# EAGLE design FollowerCounter_60mm_v010 (EAGLE 9.6.2)
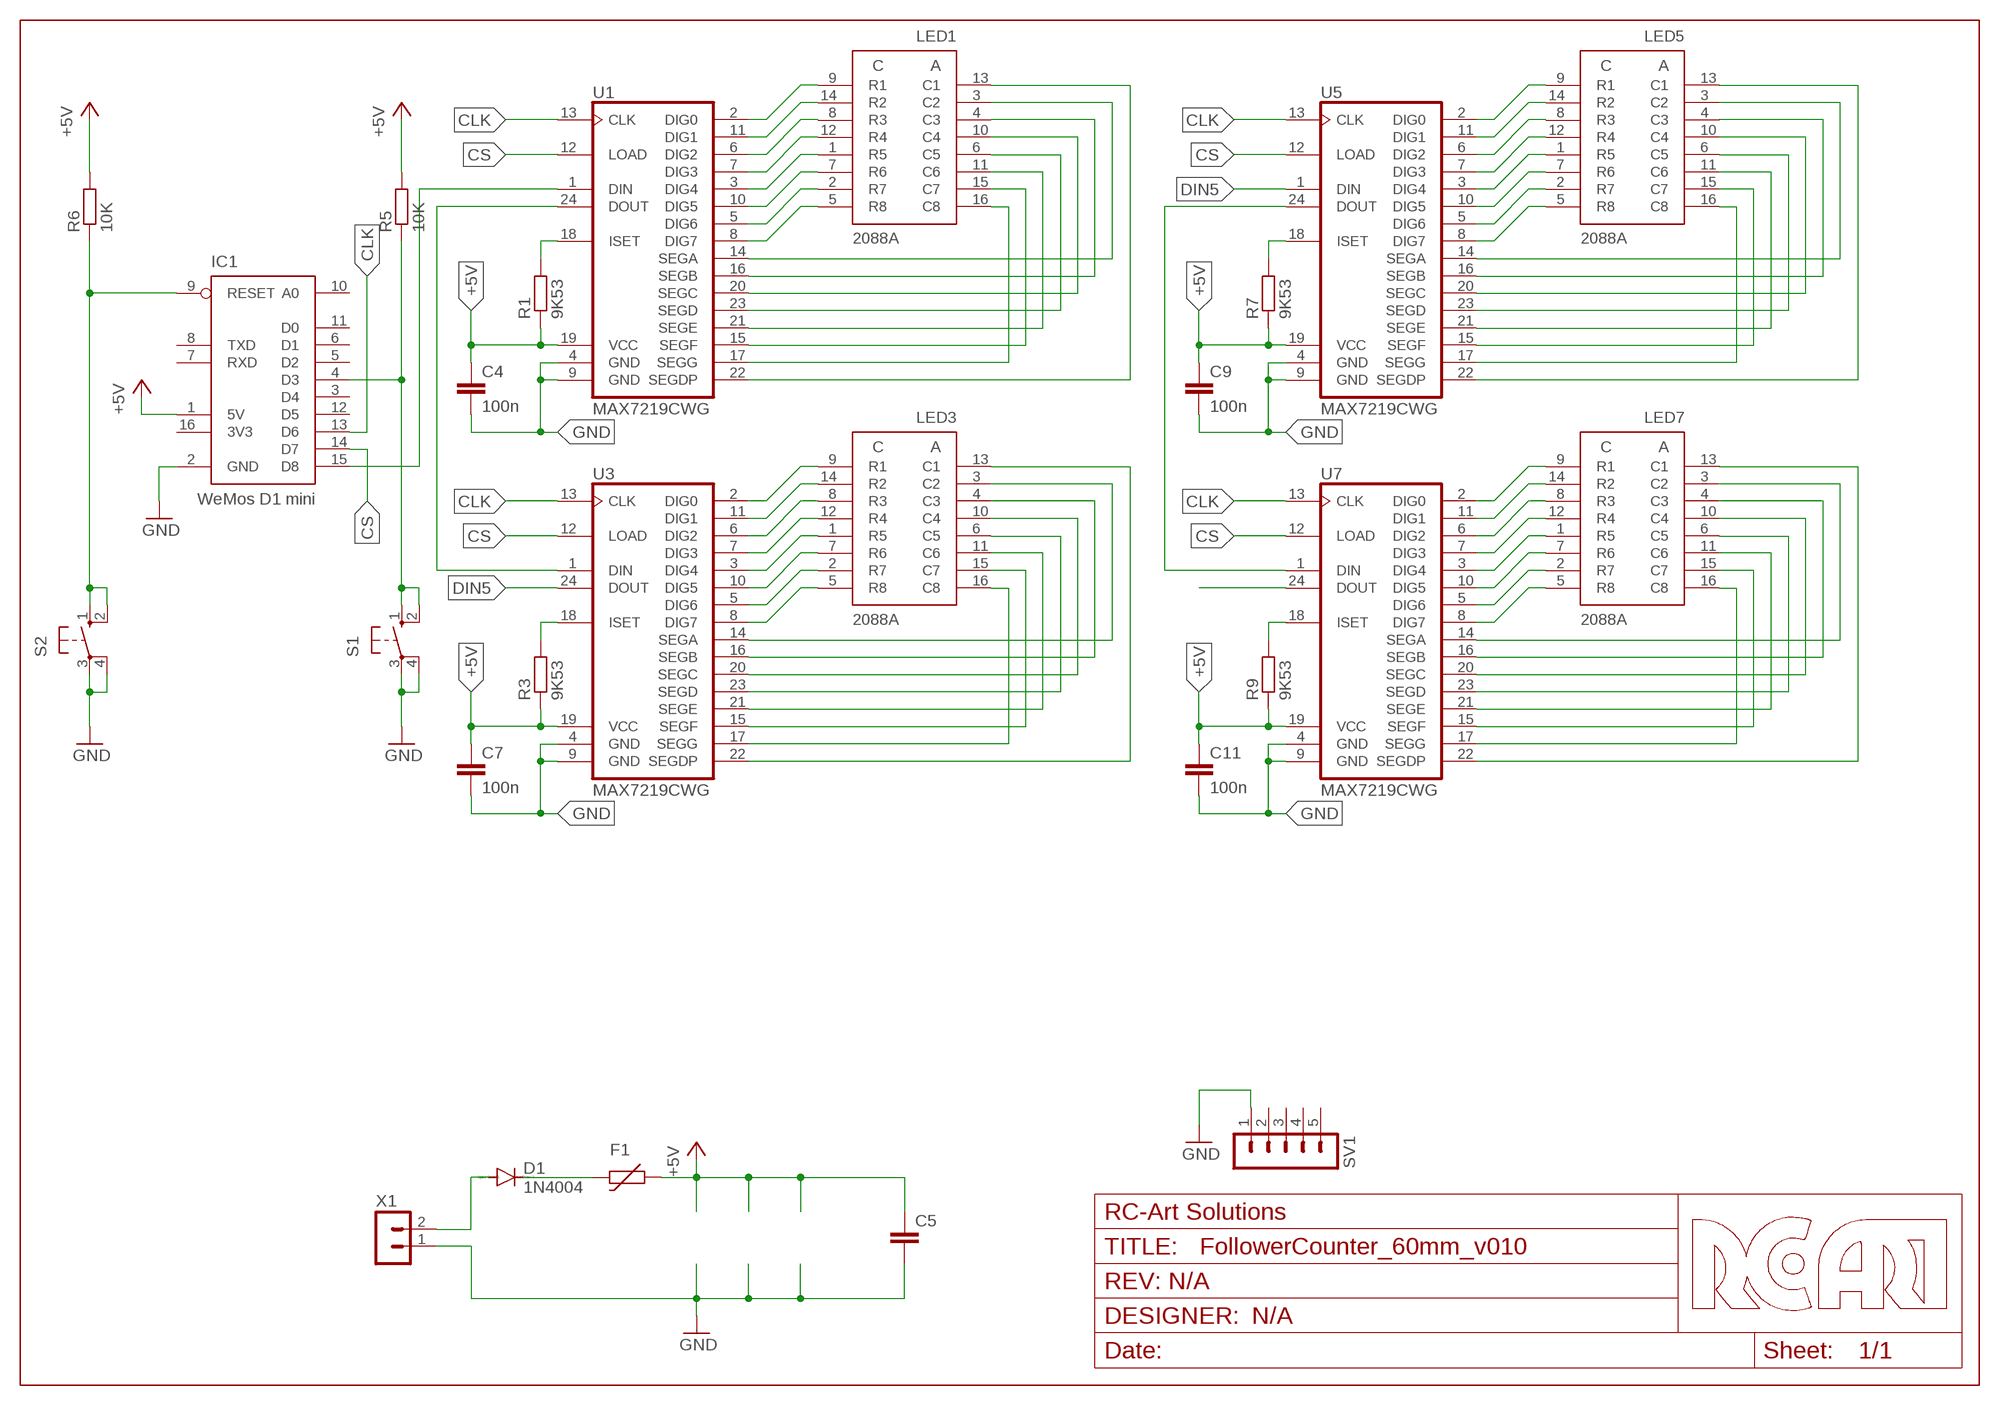
[diagram p0: schematic, sheet 1]

## Parts
C4  100n  C-EUC0805  [C0805]
C5  C-EUC0805  [C0805]
C7  100n  C-EUC0805  [C0805]
C9  100n  C-EUC0805  [C0805]
C11  100n  C-EUC0805  [C0805]
D1  1N4004  [DO41-10]
F1  MF-MSMF075/24-EU  [1812]
FRAME1  MF_FRAMEDEFAULT  [MF_FRAME_DEFAULT]
IC1  WeMos D1 mini  D1_MINI  [D1_MINI]
LED1  2088A  [8X8_60X60]
LED3  2088A  [8X8_60X60]
LED5  2088A  [8X8_60X60]
LED7  2088A  [8X8_60X60]
R1  9K53  R-EU_R0805  [R0805]
R3  9K53  R-EU_R0805  [R0805]
R5  10K  R-EU_R0805  [R0805]
R6  10K  R-EU_R0805  [R0805]
R7  9K53  R-EU_R0805  [R0805]
R9  9K53  R-EU_R0805  [R0805]
S1  10-XXS  [B3FS-10XX]
S2  10-XXS  [B3FS-10XX]
SV1  MA05-1  [MA05-1]
U1  MAX7219CWG  [SO24L]
U3  MAX7219CWG  [SO24L]
U5  MAX7219CWG  [SO24L]
U7  MAX7219CWG  [SO24L]
X1  MA02-1  [MA02-1]

## Nets
+5V: C4.1 C5.1 C7.1 C9.1 C11.1 F1.1 IC1.1(5V) R1.1 R3.1 R5.2 R6.2 R7.1 R9.1 U1.19(VCC) U3.19(VCC) U5.19(VCC) U7.19(VCC)
CLK: IC1.13(D6) U1.13(CLK) U3.13(CLK) U5.13(CLK) U7.13(CLK)
COL9: LED1.16(C8) U1.17(SEGG)
COL10: LED1.15(C7) U1.15(SEGF)
COL11: LED1.11(C6) U1.21(SEGE)
COL12: LED1.6(C5) U1.23(SEGD)
COL13: LED1.10(C4) U1.20(SEGC)
COL14: LED1.4(C3) U1.16(SEGB)
COL15: LED1.3(C2) U1.14(SEGA)
COL16: LED1.13(C1) U1.22(SEGDP)
COL25: LED3.16(C8) U3.17(SEGG)
COL26: LED3.15(C7) U3.15(SEGF)
COL27: LED3.11(C6) U3.21(SEGE)
COL28: LED3.6(C5) U3.23(SEGD)
COL29: LED3.10(C4) U3.20(SEGC)
COL30: LED3.4(C3) U3.16(SEGB)
COL31: LED3.3(C2) U3.14(SEGA)
COL32: LED3.13(C1) U3.22(SEGDP)
COL41: LED5.16(C8) U5.17(SEGG)
COL42: LED5.15(C7) U5.15(SEGF)
COL43: LED5.11(C6) U5.21(SEGE)
COL44: LED5.6(C5) U5.23(SEGD)
COL45: LED5.10(C4) U5.20(SEGC)
COL46: LED5.4(C3) U5.16(SEGB)
COL47: LED5.3(C2) U5.14(SEGA)
COL48: LED5.13(C1) U5.22(SEGDP)
COL57: LED7.16(C8) U7.17(SEGG)
COL58: LED7.15(C7) U7.15(SEGF)
COL59: LED7.11(C6) U7.21(SEGE)
COL60: LED7.6(C5) U7.23(SEGD)
COL61: LED7.10(C4) U7.20(SEGC)
COL62: LED7.4(C3) U7.16(SEGB)
COL63: LED7.3(C2) U7.14(SEGA)
COL64: LED7.13(C1) U7.22(SEGDP)
CS: IC1.14(D7) U1.12(LOAD) U3.12(LOAD) U5.12(LOAD) U7.12(LOAD)
DIN1: IC1.15(D8) U1.1(DIN)
DIN5: U3.24(DOUT) U5.1(DIN)
DOUT1: U1.24(DOUT) U3.1(DIN)
DOUT5: U5.24(DOUT) U7.1(DIN)
DOUT7: U7.24(DOUT)
GND: C4.2 C5.2 C7.2 C9.2 C11.2 IC1.2(GND) S1.3(P) S1.4(P1) S2.3(P) S2.4(P1) SV1.1 U1.4(GND) U1.9(GND) U3.4(GND) U3.9(GND) U5.4(GND) U5.9(GND) U7.4(GND) U7.9(GND) X1.1
ISET1: R1.2 U1.18(ISET)
ISET3: R3.2 U3.18(ISET)
ISET5: R7.2 U5.18(ISET)
ISET7: R9.2 U7.18(ISET)
N$76: IC1.4(D3) R5.1 S1.1(S) S1.2(S1)
N$77: IC1.9(RESET) R6.1 S2.1(S) S2.2(S1)
N$78: D1.A X1.2
N$79: D1.C F1.2
ROW9: LED1.9(R1) U1.2(DIG0)
ROW10: LED1.14(R2) U1.11(DIG1)
ROW11: LED1.8(R3) U1.6(DIG2)
ROW12: LED1.12(R4) U1.7(DIG3)
ROW13: LED1.1(R5) U1.3(DIG4)
ROW14: LED1.7(R6) U1.10(DIG5)
ROW15: LED1.2(R7) U1.5(DIG6)
ROW16: LED1.5(R8) U1.8(DIG7)
ROW25: LED3.9(R1) U3.2(DIG0)
ROW26: LED3.14(R2) U3.11(DIG1)
ROW27: LED3.8(R3) U3.6(DIG2)
ROW28: LED3.12(R4) U3.7(DIG3)
ROW29: LED3.1(R5) U3.3(DIG4)
ROW30: LED3.7(R6) U3.10(DIG5)
ROW31: LED3.2(R7) U3.5(DIG6)
ROW32: LED3.5(R8) U3.8(DIG7)
ROW41: LED5.9(R1) U5.2(DIG0)
ROW42: LED5.14(R2) U5.11(DIG1)
ROW43: LED5.8(R3) U5.6(DIG2)
ROW44: LED5.12(R4) U5.7(DIG3)
ROW45: LED5.1(R5) U5.3(DIG4)
ROW46: LED5.7(R6) U5.10(DIG5)
ROW47: LED5.2(R7) U5.5(DIG6)
ROW48: LED5.5(R8) U5.8(DIG7)
ROW57: LED7.9(R1) U7.2(DIG0)
ROW58: LED7.14(R2) U7.11(DIG1)
ROW59: LED7.8(R3) U7.6(DIG2)
ROW60: LED7.12(R4) U7.7(DIG3)
ROW61: LED7.1(R5) U7.3(DIG4)
ROW62: LED7.7(R6) U7.10(DIG5)
ROW63: LED7.2(R7) U7.5(DIG6)
ROW64: LED7.5(R8) U7.8(DIG7)
Unconnected: IC1.3(D4) IC1.5(D2) IC1.6(D1) IC1.7(RXD) IC1.8(TXD) IC1.10(A0) IC1.11(D0) IC1.12(D5) IC1.16(3V3) SV1.2 SV1.3 SV1.4 SV1.5

## Library data of the parts
C4 C5 C7 C9 C11 = rcl:C-EU: CAPACITOR, European symbol; SPICEPREFIX: C
D1 = diode:1N4004: DIODE general purpose rectifier, 1 A
F1 = fuse-bourns:MF-MSMF*?-EU: PTC Resettable Fuse Documentation Datasheet <http://www.bourns.com/data/global/pdfs/mfmsmf.pdf> Features Compliant with AEC-Q200 Rev-C- Stress Test Qualification for Passive Components in Automotive Applications 100% electrically compatible with all previous generations of 1812 SMT devices Compatible with Pb and Pb-free solder reflow profiles RoHS compliant* and halogen free** Surface mount packaging for automated assembly Standard 4532 mm (1812 mils) footprint Patents pending; CATEGORY: Circuit Protection; CURRENT-MAX: 40A; CURRENT-TRIP: 1.5A; DESCRIPTION: PTC RESETTABLE .75A 24V 1812; DOCUMENTATION_LINK: <a href="http://www.bourns.com/data/global/pdfs/mfmsmf.pdf">Datasheet</a>; DOCUMENTATION_URL: http://www.bourns.com/data/global/pdfs/mfmsmf.pdf; FAMILY: PTC Resettable Fuses; MANUFACTURER: Bourns Inc.; PACKAGE: 1812 (4532 Metric), Concave; PART_NUMBER: MF-MSMF075/24-2; R_MINMAX: 0.11 ~ 0.450 Ohm; SERIES: MF-MSMF; SUPPLIER_ITEM_LINK: <a href="http://www.digikey.com/product-detail/en/MF-MSMF075%2F24-2/MF-MSMF075%2F24-2CT-ND/662844">Details</a>; SUPPLIER_ITEM_NUMBER: MF-MSMF075/24-2CT-ND; SUPPLIER_ITEM_URL: http://www.digikey.com/product-detail/en/MF-MSMF075%2F24-2/MF-MSMF075%2F24-2CT-ND/662844; SUPPLIER_LINK: <a href="http://www.digikey.com">Home Page</a>; SUPPLIER_NAME: Digi-Key; SUPPLIER_URL: http://www.digikey.com; TIME_TO_TRIP: 0.2s; VOLTAGE-MAX: 24V
FRAME1 = rca-frames:MF_FRAME: Library: MF_Aesthetics Description: Frame for adding Meta Data to the PCB and Schematic.; DNAME: N/A; HOUSEPART: 0; POPULATE: 0; REVNUM: REV: N/A
IC1 = rca-wemos:D1_MINI
LED1 LED3 LED5 LED7 = rca-led-matrix:2088A: 8 x 8 LED Matrix Common cathode type Module pitch = 60,2 mm
R1 R3 R5-R7 R9 = rcl:R-EU_: RESISTOR, European symbol; SPICEPREFIX: R
S1 S2 = switch_omron_ehp:10-XX: OMRON SWITCH Autor: Peter Weissig Datum: 20.02.2014 Hersteller: Omron
SV1 = con-lstb:MA05-1: PIN HEADER; OC_FARNELL: unknown; OC_NEWARK: unknown
U1 U3 U5 U7 = maxim-general:MAX7219CWG
X1 = rca-con-lstb:MA02-1: PIN HEADER

## Net classes
0 default: width 0.381 mm, drill 0.508 mm, clearance 0.254 mm

## Board
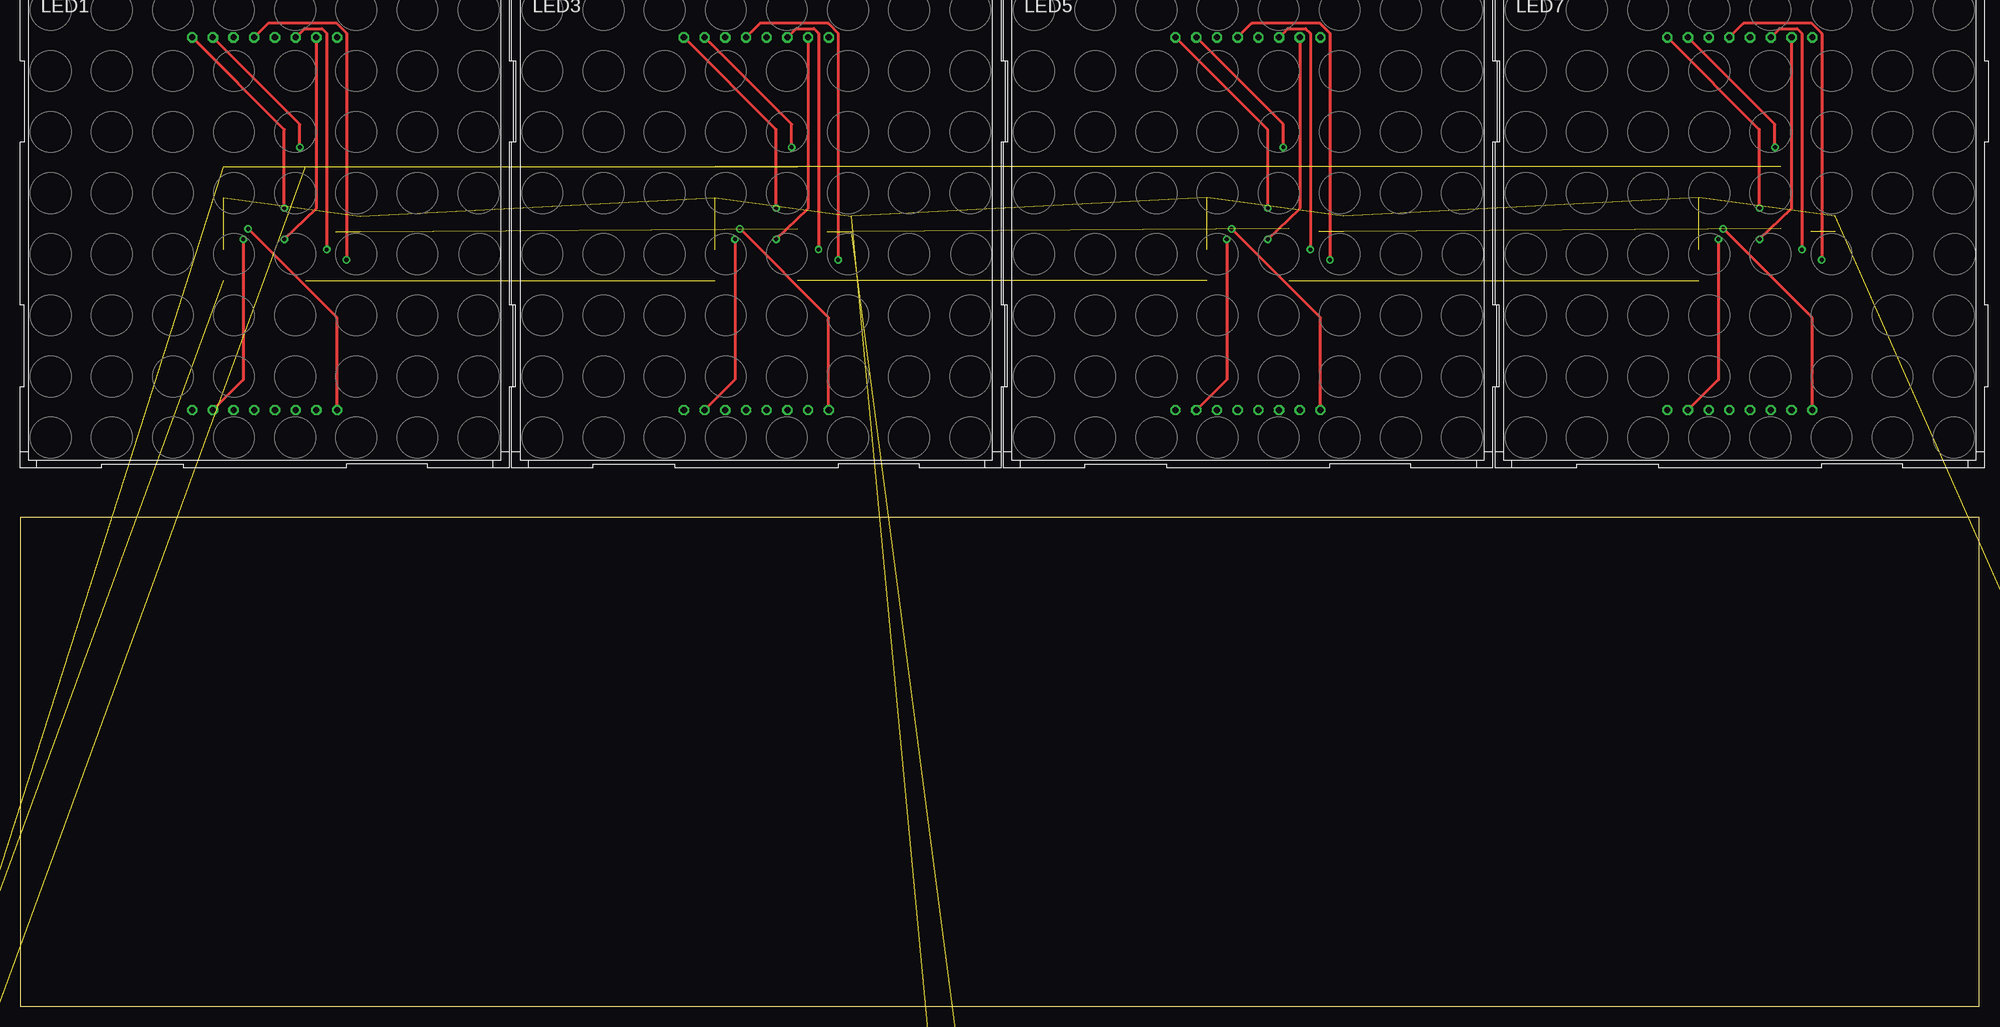
[diagram p1: board, top side]
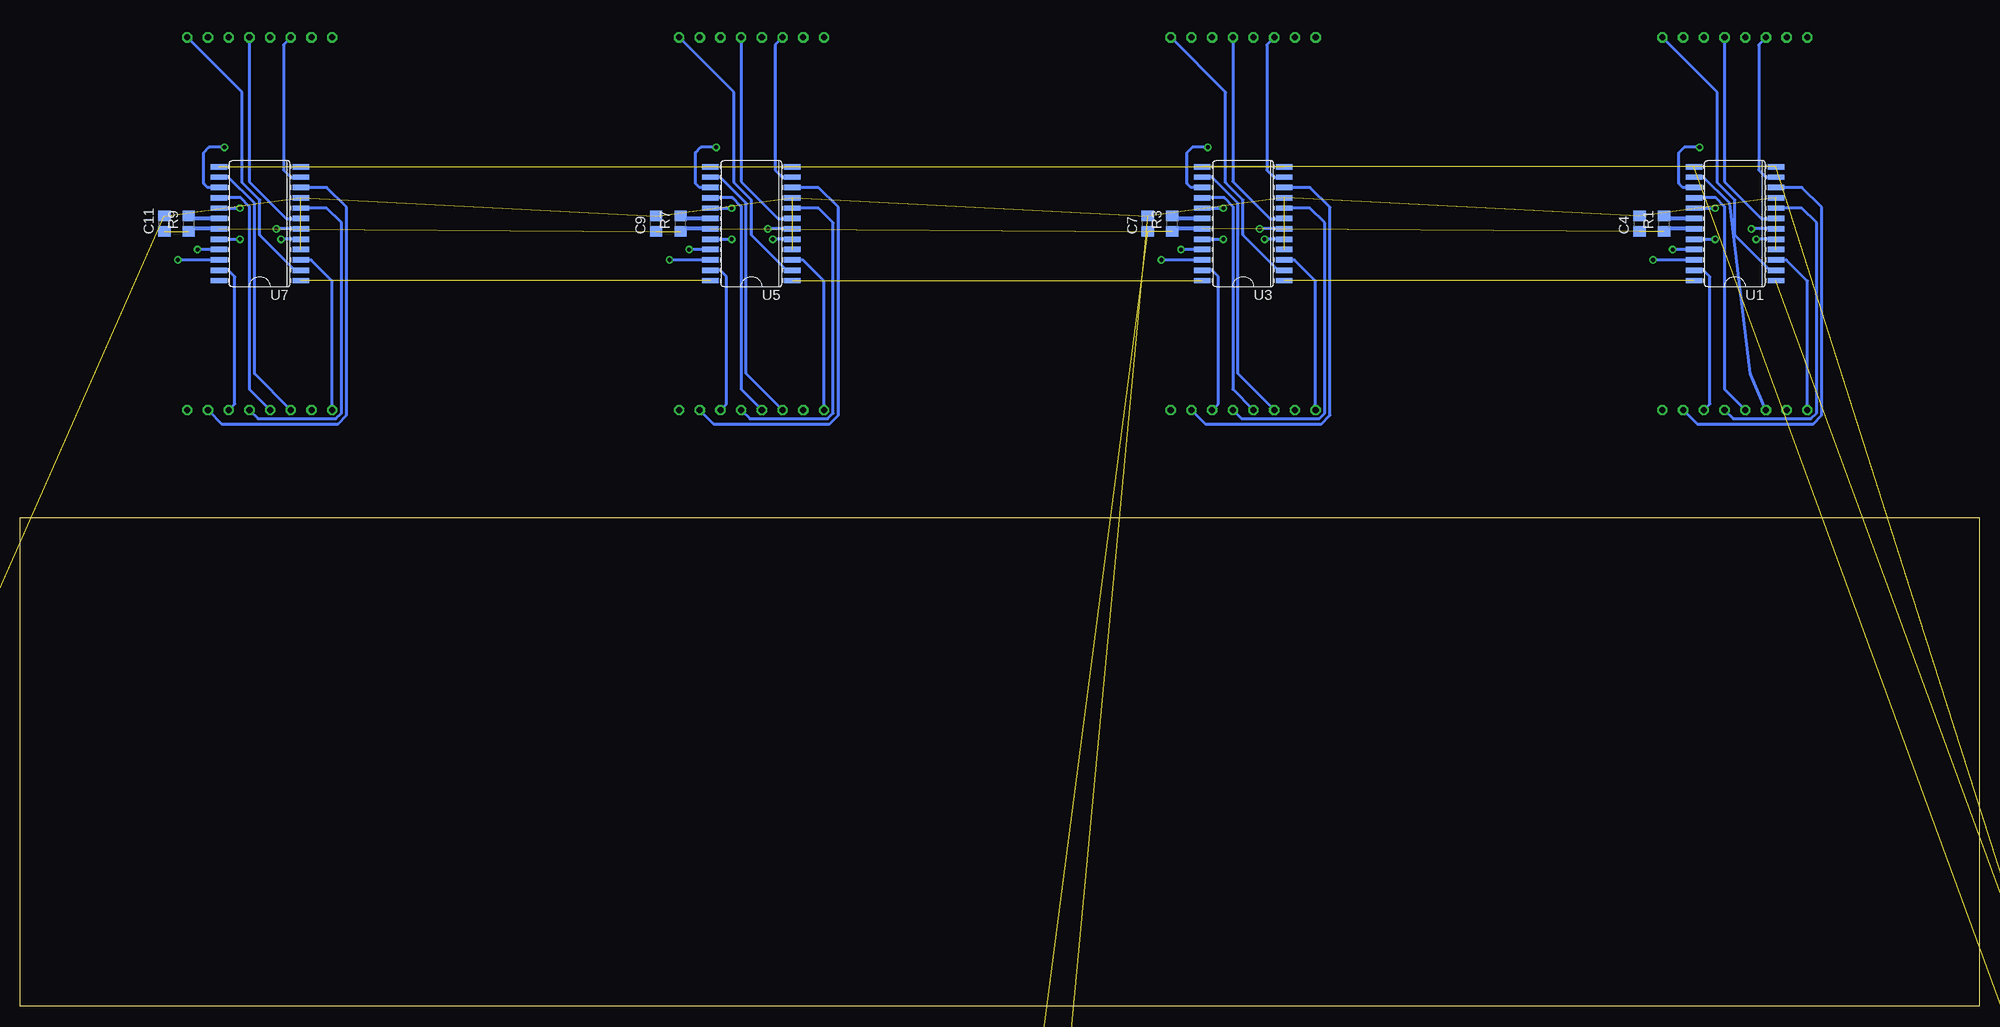
[diagram p2: board, bottom side, seen from below]

Size 240.3 x 60 mm. Coordinates in mm from the lower left corner, seen from the top.
Outline: 0,0 240.3,0 240.3,60 0,60 0,0
Copper layers (1*16): Top 0.035mm / dielectric 1.5mm / Bottom 0.035mm
Design rules "default": minimum track width 6mil, minimum drill 0.35mm, track to track 6mil, track to pad 6mil, pad to pad 6mil, via to via 6mil, smd to smd 6mil, copper to edge 40mil, drill to drill 6mil, minimum pad ring 10mil, minimum via ring 8mil, stop-mask expansion 4mil, vias tented up to drill 0mil, thermal gap 10mil

### Footprints (pad centres in the part's own frame; a part is rotated, then mirrored left to right if it is on the bottom)
C0805 = smd 1.3 x 1.5: 1 -0.95,0; 2 0.95,0
DO41-10 = drill 1.118: A 5.08,0; C -5.08,0
1812 = smd 1.55 x 3.3: 1 -2.185,0; 2 2.185,0
D1_MINI = drill 0.9 pad 1.5 octagon: 1 11.43,0; 2 11.43,2.54; 3 11.43,5.08; 4 11.43,7.62; 5 11.43,10.16; 6 11.43,12.7; 7 11.43,15.24; 8 11.43,17.78; 9 -11.43,17.78; 10 -11.43,15.24; 11 -11.43,12.7; 12 -11.43,10.16; 13 -11.43,7.62; 14 -11.43,5.08; 15 -11.43,2.54; 16 -11.43,0
8X8_60X60 = drill 0.75 octagon: 1 -8.89,-22.86; 2 -6.35,-22.86; 3 -3.81,-22.86; 4 -1.27,-22.86; 5 1.27,-22.86; 6 3.81,-22.86; 7 6.35,-22.86; 8 8.89,-22.86; 9 8.89,22.86; 10 6.35,22.86; 11 3.81,22.86; 12 1.27,22.86; 13 -1.27,22.86; 14 -3.81,22.86; 15 -6.35,22.86; 16 -8.89,22.86
R0805 = smd 1.3 x 1.5: 1 -0.95,0; 2 0.95,0
B3FS-10XX = smd 1.8 x 1.4: 1 -4,2.25; 2 4,2.25; 3 -4,-2.25; 4 4,-2.25
MA05-1 = drill 1.016 long: 1 -5.08,0; 2 -2.54,0; 3 0,0; 4 2.54,0; 5 5.08,0
SO24L = smd 0.66 x 2.032: 1 -6.985,-5.029; 2 -5.715,-5.029; 3 -4.445,-5.029; 4 -3.175,-5.029; 5 -1.905,-5.029; 6 -0.635,-5.029; 7 0.635,-5.029; 8 1.905,-5.029; 9 3.175,-5.029; 10 4.445,-5.029; 11 5.715,-5.029; 12 6.985,-5.029; 13 6.985,5.029; 14 5.715,5.029; 15 4.445,5.029; 16 3.175,5.029; 17 1.905,5.029; 18 0.635,5.029; 19 -0.635,5.029; 20 -1.905,5.029; 21 -3.175,5.029; 22 -4.445,5.029; 23 -5.715,5.029; 24 -6.985,5.029
MA02-1 = drill 1.016 long: 1 -2.54,0; 2 0,0

### Placement (x,y rotation side)
C4  41.66,96.04 90 bottom  (outside the outline)
C5  -29.84,-26.67 180 bottom  (outside the outline)
C7  101.98,96.04 90 bottom  (outside the outline)
C9  162.31,96.04 90 bottom  (outside the outline)
C11  222.63,96.04 90 bottom  (outside the outline)
D1  60.33,-29.21 270 bottom  (outside the outline)
F1  77.47,-30.48 270 bottom  (outside the outline)
FRAME1  0,-3.81 0 top  (outside the outline)
IC1  -30.48,-43.66 90 bottom  (outside the outline)
LED1  29.96,96.04 0 top  (outside the outline)
LED3  90.28,96.04 0 top  (outside the outline)
LED5  150.61,96.04 0 top  (outside the outline)
LED7  210.94,96.04 0 top  (outside the outline)
R1  38.66,96.04 90 bottom  (outside the outline)
R3  98.98,96.04 90 bottom  (outside the outline)
R5  117.47,-16.51 0 bottom  (outside the outline)
R6  117.47,-46.99 0 bottom  (outside the outline)
R7  159.31,96.04 90 bottom  (outside the outline)
R9  219.63,96.04 90 bottom  (outside the outline)
S1  117.47,-23.5 0 bottom  (outside the outline)
S2  117.47,-52.7 0 bottom  (outside the outline)
SV1  249.99,30 270 bottom  (outside the outline)
U1  29.96,96.04 90 bottom  (outside the outline)
U3  90.28,96.04 90 bottom  (outside the outline)
U5  150.61,96.04 90 bottom  (outside the outline)
U7  210.94,96.04 90 bottom  (outside the outline)
X1  48.9,-28.57 0 bottom  (outside the outline)

### Tracks (layer width: path | path; a pad name or v marks a point on that pad's centre or on a via)
+5V  (12 unrouted)
  Bottom 0.508: U1.19 38.34,95.41 R1.1 | U3.19 98.67,95.41 R3.1 | U5.19 159,95.41 R7.1 | U7.19 219.32,95.41 R9.1
CLK  (4 unrouted)
COL9  (via drill 0.51)
  Top 0.381: LED1.16 32.38,107.58 v32.38,97.94
  Bottom 0.381: U1.17 v32.38,97.94
COL10  (via drill 0.51)
  Top 0.381: v34.29,105.41 34.29,108.22 LED1.15
  Bottom 0.381: U1.15 36.35,100.48 36.83,100.97 36.83,104.78 36.2,105.41 v34.29,105.41
COL11  (via drill 0.51)
  Top 0.381: LED1.11 34.85,119.97 37.02,119.97 37.59,119.4 v37.59,92.86
  Bottom 0.381: U1.21 v37.59,92.86
COL12
  Bottom 0.381: U1.23 33.81,90.33 33.02,89.53 33.02,73.93 LED1.6
COL13  (via drill 0.51)
  Top 0.381: LED1.10 36.31,97.91 v32.38,94.14
  Bottom 0.381: 34.83,93.98 U1.20 v32.38,94.14
COL14
  Bottom 0.381: LED1.4 31.23,75.72 31.23,98.16 32.29,99.22 U1.16
COL15
  Bottom 0.381: U1.14 33.81,101.75 30.59,98.54 28.05,77.62 LED1.3
COL16  (via drill 0.51)
  Top 0.381: v40.01,91.59 40.01,119.41 38.8,120.61 30.4,120.61 LED1.13
  Bottom 0.381: U1.22 v40.01,91.59
COL25  (via drill 0.51)
  Top 0.381: LED3.16 92.71,107.58 v92.71,97.94
  Bottom 0.381: U3.17 v92.71,97.94
COL26  (via drill 0.51)
  Top 0.381: v94.61,105.41 94.61,108.22 LED3.15
  Bottom 0.381: U3.15 96.67,100.48 97.16,100.97 97.16,104.78 96.52,105.41 v94.61,105.41
COL27  (via drill 0.51)
  Top 0.381: LED3.11 95.17,119.97 97.34,119.97 97.92,119.4 v97.92,92.86
  Bottom 0.381: U3.21 v97.92,92.86
COL28
  Bottom 0.381: U3.23 94.14,90.33 93.34,89.53 93.34,73.93 LED3.6
COL29  (via drill 0.51)
  Top 0.381: LED3.10 96.64,97.91 v92.71,94.14
  Bottom 0.381: 95.16,93.98 U3.20 v92.71,94.14
COL30
  Bottom 0.381: LED3.4 91.56,75.72 91.56,98.16 92.61,99.22 U3.16
COL31
  Bottom 0.381: U3.14 94.14,101.75 90.92,98.54 90.92,77.62 LED3.3
COL32  (via drill 0.51)
  Top 0.381: v100.33,91.59 100.33,119.41 99.13,120.61 90.72,120.61 LED3.13
  Bottom 0.381: U3.22 v100.33,91.59
COL41  (via drill 0.51)
  Top 0.381: LED5.16 153.03,107.58 v153.03,97.94
  Bottom 0.381: U5.17 v153.03,97.94
COL42  (via drill 0.51)
  Top 0.381: v154.94,105.41 154.94,108.22 LED5.15
  Bottom 0.381: U5.15 157,100.48 157.48,100.97 157.48,104.78 156.84,105.41 v154.94,105.41
COL43  (via drill 0.51)
  Top 0.381: LED5.11 155.5,119.97 157.67,119.97 158.24,119.4 v158.24,92.86
  Bottom 0.381: U5.21 v158.24,92.86
COL44
  Bottom 0.381: U5.23 154.46,90.33 153.67,89.53 153.67,73.93 LED5.6
COL45  (via drill 0.51)
  Top 0.381: LED5.10 156.96,97.91 v153.03,94.14
  Bottom 0.381: 155.48,93.98 U5.20 v153.03,94.14
COL46
  Bottom 0.381: LED5.4 151.88,75.72 151.88,98.16 152.94,99.22 U5.16
COL47
  Bottom 0.381: U5.14 154.46,101.75 151.25,98.54 151.25,77.62 LED5.3
COL48  (via drill 0.51)
  Top 0.381: v160.66,91.59 160.66,119.41 159.46,120.61 151.05,120.61 LED5.13
  Bottom 0.381: U5.22 v160.66,91.59
COL57  (via drill 0.51)
  Top 0.381: LED7.16 213.36,107.58 v213.36,97.94
  Bottom 0.381: U7.17 v213.36,97.94
COL58  (via drill 0.51)
  Top 0.381: v215.26,105.41 215.26,108.22 LED7.15
  Bottom 0.381: U7.15 217.32,100.48 217.81,100.97 217.81,104.78 217.17,105.41 v215.26,105.41
COL59  (via drill 0.51)
  Top 0.381: LED7.11 215.82,119.97 217.99,119.97 218.57,119.4 v218.57,92.86
  Bottom 0.381: U7.21 v218.57,92.86
COL60
  Bottom 0.381: U7.23 214.78,90.33 214,89.53 214,73.93 LED7.6
COL61  (via drill 0.51)
  Top 0.381: LED7.10 217.28,97.91 v213.36,94.14
  Bottom 0.381: 215.81,93.98 U7.20 v213.36,94.14
COL62
  Bottom 0.381: LED7.4 212.21,75.72 212.21,98.16 213.26,99.22 U7.16
COL63
  Bottom 0.381: U7.14 214.78,101.75 211.57,98.54 211.57,77.62 LED7.3
COL64  (via drill 0.51)
  Top 0.381: v220.98,91.59 220.98,119.41 219.78,120.61 211.37,120.61 LED7.13
  Bottom 0.381: U7.22 v220.98,91.59
CS  (4 unrouted)
DIN1  (1 unrouted)
DIN5  (1 unrouted)
DOUT1  (1 unrouted)
DOUT5  (1 unrouted)
GND  (19 unrouted)
ISET1
  Bottom 0.508: U1.18 38.34,96.67 R1.2
ISET3
  Bottom 0.508: U3.18 98.67,96.67 R3.2
ISET5
  Bottom 0.508: U5.18 159,96.67 R7.2
ISET7
  Bottom 0.508: U7.18 219.32,96.67 R9.2
N$76  (3 unrouted)
N$77  (3 unrouted)
N$78  (1 unrouted)
N$79  (1 unrouted)
ROW9
  Bottom 0.381: U1.2 25.07,90.19 25.5,90.19 29.96,94.65 29.96,98.93 32.12,101.09 32.12,112.17 LED1.9
ROW10
  Bottom 0.381: LED1.14 27.05,118 27.05,102.62 26.19,101.75 U1.11
ROW11  (via drill 0.51)
  Top 0.381: LED1.8 38.85,84.5 v27.94,95.41
  Bottom 0.381: U1.6 v27.94,95.41
ROW12
  Bottom 0.381: LED1.12 31.23,101.21 26.7,96.67 U1.7
ROW13
  Bottom 0.381: U1.3 23.64,91.59 21.07,89.02 LED1.1
ROW14
  Bottom 0.381: U1.10 21.75,100.48 19.3,98.04 19.3,72.53 20.36,71.47 34.6,71.47 LED1.7
ROW15  (via drill 0.51)
  Top 0.381: v27.34,94.14 27.34,76.91 LED1.2
  Bottom 0.381: U1.5 v27.34,94.14
ROW16
  Bottom 0.381: U1.8 21.75,97.94 19.94,96.14 19.94,72.79 20.62,72.11 30.16,72.11 LED1.5
ROW25
  Bottom 0.381: U3.2 85.39,90.19 85.82,90.19 90.28,94.65 90.28,98.93 92.44,101.09 92.44,112.17 LED3.9
ROW26
  Bottom 0.381: LED3.14 87.38,118 87.38,102.62 86.52,101.75 U3.11
ROW27  (via drill 0.51)
  Top 0.381: LED3.8 99.17,84.5 v88.27,95.41
  Bottom 0.381: U3.6 v88.27,95.41
ROW28
  Bottom 0.381: LED3.12 91.56,101.21 87.02,96.67 U3.7
ROW29
  Bottom 0.381: U3.3 83.97,91.59 81.39,89.02 LED3.1
ROW30
  Bottom 0.381: U3.10 82.07,100.48 79.63,98.04 79.63,72.53 80.69,71.47 94.93,71.47 LED3.7
ROW31  (via drill 0.51)
  Top 0.381: v87.67,94.14 87.67,76.91 LED3.2
  Bottom 0.381: U3.5 v87.67,94.14
ROW32
  Bottom 0.381: U3.8 82.07,97.94 80.26,96.14 80.26,72.79 80.95,72.11 90.48,72.11 LED3.5
ROW41
  Bottom 0.381: U5.2 145.72,90.19 146.15,90.19 150.61,94.65 150.61,98.93 152.77,101.09 152.77,112.17 LED5.9
ROW42
  Bottom 0.381: LED5.14 147.7,118 147.7,102.62 146.84,101.75 U5.11
ROW43  (via drill 0.51)
  Top 0.381: LED5.8 159.5,84.5 v148.59,95.41
  Bottom 0.381: U5.6 v148.59,95.41
ROW44
  Bottom 0.381: LED5.12 151.88,101.21 147.35,96.67 U5.7
ROW45
  Bottom 0.381: U5.3 144.29,91.59 141.72,89.02 LED5.1
ROW46
  Bottom 0.381: U5.10 142.4,100.48 139.95,98.04 139.95,72.53 141.01,71.47 155.25,71.47 LED5.7
ROW47  (via drill 0.51)
  Top 0.381: v147.99,94.14 147.99,76.91 LED5.2
  Bottom 0.381: U5.5 v147.99,94.14
ROW48
  Bottom 0.381: U5.8 142.4,97.94 140.59,96.14 140.59,72.79 141.28,72.11 150.81,72.11 LED5.5
ROW57
  Bottom 0.381: U7.2 206.05,90.19 206.47,90.19 210.94,94.65 210.94,98.93 213.09,101.09 213.09,112.17 LED7.9
ROW58
  Bottom 0.381: LED7.14 208.03,118 208.03,102.62 207.16,101.75 U7.11
ROW59  (via drill 0.51)
  Top 0.381: LED7.8 219.82,84.5 v208.91,95.41
  Bottom 0.381: U7.6 v208.91,95.41
ROW60
  Bottom 0.381: LED7.12 212.21,101.21 207.67,96.67 U7.7
ROW61
  Bottom 0.381: U7.3 204.62,91.59 202.04,89.02 LED7.1
ROW62
  Bottom 0.381: U7.10 202.72,100.48 200.28,98.04 200.28,72.53 201.34,71.47 215.58,71.47 LED7.7
ROW63  (via drill 0.51)
  Top 0.381: v208.32,94.14 208.32,76.91 LED7.2
  Bottom 0.381: U7.5 v208.32,94.14
ROW64
  Bottom 0.381: U7.8 202.72,97.94 200.91,96.14 200.91,72.79 201.6,72.11 211.13,72.11 LED7.5